# EAGLE design openusbfxo-dongle-v0.90 (EAGLE 5.11)
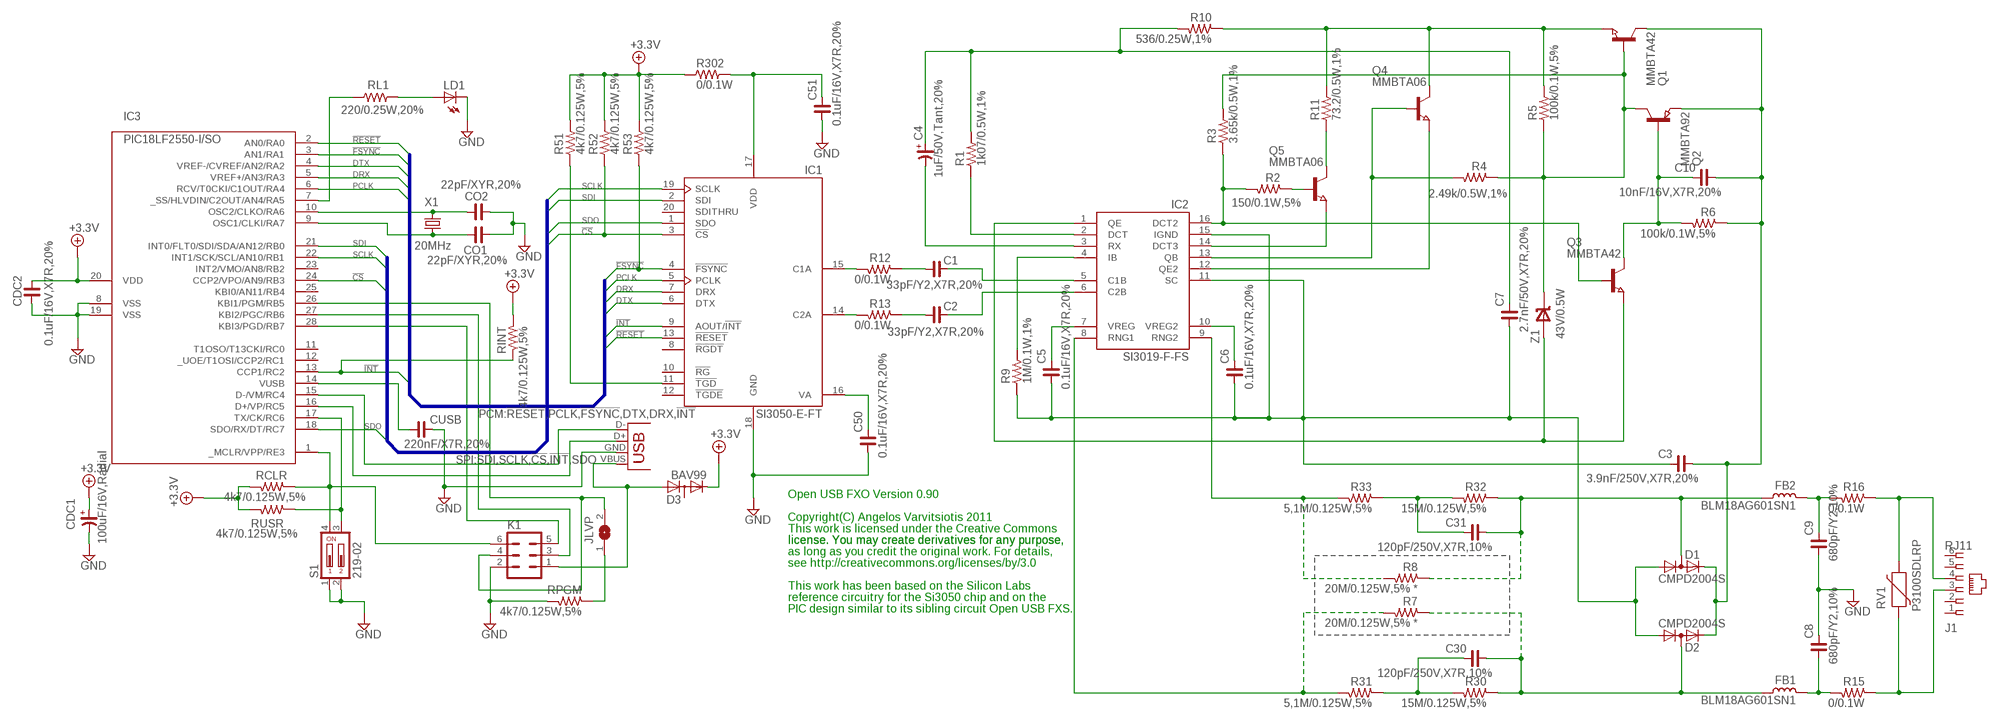
[diagram p0: schematic, sheet 1]

## Parts
C1  33pF/Y2,X7R,20%  C_0805  [C0805]
C2  33pF/Y2,X7R,20%  C_0805  [C0805]
C3  3.9nF/250V,X7R,20%  C_1812  [C1812]
C4  1uF/50V,Tant,20%  CP_6032-28R  [C6032-28R/T]
C5  0.1uF/16V,X7R,20%  C_0603  [C0603]
C6  0.1uF/16V,X7R,20%  C_0603  [C0603]
C7  2.7nF/50V,X7R,20%  C_0805  [C0805]
C8  680pF/Y2,10%  C_0603  [C0603]
C9  680pF/Y2,10%  C_0603  [C0603]
C10  10nF/16V,X7R,20%  C_0603  [C0603]
C30  120pF/250V,X7R,10%  C_1210  [C1210]
C31  120pF/250V,X7R,10%  C_1210  [C1210]
C50  0.1uF/16V,X7R,20%  C_0603  [C0603]
C51  0.1uF/16V,X7R,20%  C_0603  [C0603]
CDC1  100uF/16V,Radial  CP_E-025X060  [CE-025X060]
CDC2  0.1uF/16V,X7R,20%  C_0603  [C0603]
CO1  22pF/XYR,20%  C_0805  [C0805]
CO2  22pF/XYR,20%  C_0805  [C0805]
CUSB  220nF/X7R,20%  C_0805  [C0805]
D1  CMPD2004S  CMPD200X  [SOT23]
D2  CMPD2004S  CMPD200X  [SOT23]
D3  BAV99  [SOT23]
FB1  BLM18AG601SN1  L_0603  [L0603]
FB2  BLM18AG601SN1  L_0603  [L0603]
IC1  SI3050-E-FT  [TSSOP-20]
IC2  SI3019-F-FS  [SOIC-16]
IC3  PIC18LF2550-I/SO  [SO-28W]
J1  RJ11  RJ-11/12TH  [RJ-11/12]
JLVP  SJ  [SJ]
K1  MA03-2  [MA03-2]
K2  USB-A-H  [USB-A-H]
LD1  LEDCHIPLED_1206  [CHIPLED_1206]
Q1  MMBTA42  NPN-TRANSISTOR_SOT23  [SOT23]
Q2  MMBTA92  PNP-TRANSISTOR_SOT23  [SOT23]
Q3  MMBTA42  NPN-TRANSISTOR_SOT23  [SOT23]
Q4  MMBTA06  NPN-TRANSISTOR_SOT23  [SOT23]
Q5  MMBTA06  NPN-TRANSISTOR_SOT23  [SOT23]
R1  1k07/0.5W,1%  R_1210  [R1210]
R2  150/0.1W,5%  R_0805  [R0805]
R3  3.65k/0.5W,1%  R_1210  [R1210]
R4  2.49k/0.5W,1%  R_1210  [R1210]
R5  100k/0.1W,5%  R_0805  [R0805]
R6  100k/0.1W,5%  R_0805  [R0805]
R7  20M/0.125W,5% *  R_0805  [R0805]
R8  20M/0.125W,5% *  R_0805  [R0805]
R9  1M/0.1W,1%  R_0805  [R0805]
R10  536/0.25W,1%  R_1206  [R1206]
R11  73.2/0.5W,1%  R_1210  [R1210]
R12  0/0.1W  R_0805  [R0805]
R13  0/0.1W  R_0805  [R0805]
R15  0/0.1W  R_0603  [R0603]
R16  0/0.1W  R_0603  [R0603]
R30  15M/0.125W,5%  R_0805  [R0805]
R31  5,1M/0.125W,5%  R_0805  [R0805]
R32  15M/0.125W,5%  R_0805  [R0805]
R33  5,1M/0.125W,5%  R_0805  [R0805]
R51  4k7/0.125W,5%  R_0805  [R0805]
R52  4k7/0.125W,5%  R_0805  [R0805]
R53  4k7/0.125W,5%  R_0805  [R0805]
R302  0/0.1W  R_0603  [R0603]
RCLR  4k7/0.125W,5%  R_0805  [R0805]
RINT  4k7/0.125W,5%  R_0805  [R0805]
RL1  220/0.25W,20%  R_1206  [R1206]
RPGM  4k7/0.125W,5%  R_0805  [R0805]
RUSR  4k7/0.125W,5%  R_0805  [R0805]
RV1  P3100SDLRP  SIDACTOR  [DO-214AA]
S1  219-02  [CTS-219-02]
X1  20MHz  CRYSTALHC49S  [HC49/S]
Z1  43V/0.5W  ZENER-SOD123  [SOD-123]

## Nets
!CS: IC1.3(!CS) IC3.24(CCP2/VPO/AN9/RB3) R52.1
!FSYNC: IC1.4(!FSYNC) IC3.3(AN1/RA1) R53.1
!INT: IC1.9(AOUT/!INT) IC3.13(CCP1/RC2) RINT.2
!RESET: IC1.13(!RESET) IC3.2(AN0/RA0)
+3.3V: CDC1.+ CDC2.2 D3.2(C) IC3.20(VDD) R51.2 R52.2 R53.2 R302.1 RCLR.2 RINT.1 RUSR.2
C1B: C1.1 IC2.5(C1B)
C2B: C2.1 IC2.6(C2B)
DCT: IC2.2(DCT) R1.1
DCT2: IC2.16(DCT2) Q3.1(B) R2.2 R3.1
DCT3: IC2.14(DCT3) Q5.2(E)
DRX: IC1.7(DRX) IC3.5(VREF+/AN3/RA3)
DTX: IC1.6(DTX) IC3.4(VREF-/CVREF/AN2/RA2)
GND: C8.2 C9.1 C50.1 C51.1 CDC1.- CDC2.1 CO1.1 CO2.1 CUSB.2 IC1.18(GND) IC3.8(VSS) IC3.19(VSS) K1.2 K2.GND(VBUS) LD1.C RPGM.2 S1.1 S1.2
IB: IC2.4(IB) R9.2
IGND: C3.2 C5.1 C6.1 C7.1 D1.1(A) D2.1(A) IC2.11(SC) IC2.15(IGND) R9.1
IVCC: C3.1 C10.1 D1.2(K) D2.2(K) Q1.3(C) Q2.2(E) R6.1
N$1: C50.2 IC1.16(VA)
N$6: C4.+ C7.2 R1.2 R10.2
N$9: Q1.1(B) Q2.3(C) R3.2 R4.1 R5.1 Z1.C
N$10: C10.2 Q2.1(B) Q3.3(C) R6.2
N$13: C1.2 R12.1
N$15: C2.2 R13.1
N$16: IC1.15(C1A) R12.2
N$17: IC1.14(C2A) R13.2
N$18: Q1.2(E) Q4.3(C) R5.2 R10.1 R11.2
N$19: C9.2 FB2.2 R16.2
N$20: Q5.3(C) R11.1
N$21: Q5.1(B) R2.1
N$26: C31.2 R32.2 R33.1
N$27: C30.2 R30.2 R31.1
N$28: C30.1 D2.3(AK) FB1.1 R7.1 R30.1
N$29: IC1.11(!TGD) R51.1
N$31: C31.1 D1.3(AK) FB2.1 R8.1 R32.1
N$33: J1.4 R16.1 RV1.P$2
N$34: C8.1 FB1.2 R15.2
N$35: J1.3 R15.1 RV1.P$1
N$36: IC3.7(_SS/HLVDIN/C2OUT/AN4/RA5) RL1.1
N$37: LD1.A RL1.2
N$38: C51.2 IC1.17(VDD) R302.2
N$39: CO2.2 IC3.10(OSC2/CLKO/RA6) X1.2
N$40: CO1.2 IC3.9(OSC1/CLKI/RA7) X1.1
N$41: CUSB.1 IC3.14(VUSB)
N$42: IC3.15(D-/VM/RC4) K2.D-(D+)
N$43: IC3.16(D+/VP/RC5) K2.D+(D-)
N$44: IC3.1(_MCLR/VPP/RE3) K1.6 RCLR.1 S1.4
N$45: IC3.17(TX/CK/RC6) RUSR.1 S1.3
N$46: IC3.28(KBI3/PGD/RB7) K1.5
N$47: JLVP.1 RPGM.1
N$49: IC3.27(KBI2/PGC/RB6) K1.3
N$50: IC3.26(KBI1/PGM/RB5) JLVP.2 K1.4
PCLK: IC1.5(PCLK) IC3.6(RCV/T0CKI/C1OUT/RA4)
QB: IC2.13(QB) Q4.1(B) R4.2
QE: IC2.1(QE) Q3.2(E) Z1.A
QE2: IC2.12(QE2) Q4.2(E)
RNG1: IC2.8(RNG1) R7.2 R31.2
RNG2: IC2.9(RNG2) R8.2 R33.2
RX: C4.- IC2.3(RX)
SCLK: IC1.19(SCLK) IC3.22(INT1/SCK/SCL/AN10/RB1)
SDI: IC1.2(SDI) IC3.21(INT0/FLT0/SDI/SDA/AN12/RB0)
SDO: IC1.1(SDO) IC3.18(SDO/RX/DT/RC7)
VBUS: D3.1(A) K1.1 K2.VBUS(GND)
VREG: C5.2 IC2.7(VREG)
VREG2: C6.2 IC2.10(VREG2)
Unconnected: D3.3(AC) IC1.8(!RGDT) IC1.10(!RG) IC1.12(!TGDE) IC1.20(SDITHRU) IC3.11(T1OSO/T13CKI/RC0) IC3.12(_UOE/T1OSI/CCP2/RC1) IC3.23(INT2/VMO/AN8/RB2) IC3.25(KBI0/AN11/RB4) J1.1 J1.2 J1.5 J1.6

## Buses
PCM:!RESET,PCLK,!FSYNC,DTX,DRX,!INT
SPI:SDI,SCLK,!CS,!INT,SDO

## Notes on the sheet
- Open USB FXO Version 0.90
- Copyright(C) Angelos Varvitsiotis 2011
- This work is licensed under the Creative Commons
- license. You may create derivatives for any purpose, | license. You may create derivatives for any purpose,
- as long as you credit the original work. For details,
- see http://creativecommons.org/licenses/by/3.0
- This work has been based on the Silicon Labs
- reference circuitry for the Si3050 chip and on the
- PIC design similar to its sibling circuit Open USB FXS.

## Library data of the parts
C1-C3 C5-C10 C30 C31 C50 C51 CDC2 CO1 CO2 CUSB = rc-master:C_: NON-POLARIZED CAP
C4 CDC1 = rc-master:CP_: POLARIZED CAP
D1 D2 = fxosemi:CMPD200X: Central Semiconductor dual diodes CMP2003 and CMP2004
D3 = sevt:BAV99
FB1 FB2 = rc-master:L_: INDUCTOR
IC1 = SiLabs3050-18:SI3050-E-FT: Silicon Labs Si3050
IC2 = SiLabs3050-18:SI3019-F-FS: Silicon Labs Si3019
IC3 = microchip-pic18fxx5x:PIC18*2550: PIC18*2550 Microchip FLASH Microcontroller with FS-USB DEVICE FEATURES Feature PIC18*2550 Program Memory (bytes) 32k Program Memory (instructions) 16384 I/O Ports Ports A, B, C, (E) Capture/Compare/PWM Modules 2 Enhanced Capture/Compare/PWM Modules 0 Parallel Communications (PSP) No 10-bit Analog-to-Digital Module 10 input Channels Package Types 28-pin PDIP 28-pin SOIC NOTES: F only after 18, means standard voltage range from 4.2v to 5.5v LF after 18, means extended voltage range from 2.0v to 5.5v T after entire device number, means supplied in tape and reel TQFP packages only -E before / denotes extended temperature range from -40°C to +120°C -I before / denotes industrial temperature range from -40°C to +85°C /PT suffix denotes TQFP package /SO suffix denotes SOIC package /SP suffix denotes Skinny Plastic DIP package /P suffix denotes Plastic DIP package /ML suffix denotes QFN package
J1 = connectors:RJ-11/12: 6 Pin RJ-12 Connector Digikey Part Number: A9031-ND
JLVP = jumper:SJ: SMD solder JUMPER
K1 = con-lstb:MA03-2: PIN HEADER
K2 = SparkFun:USB: USB Connectors USB-B-PTH is fully proven SKU : PRT-00139 USB-miniB is fully proven SKU : PRT-00587 USB-A-PCB is untested. USB-A-H is throughly reviewed, but untested. Spark Fun Electronics SKU : PRT-00437 USB-B-SMT is throughly reviewed, but untested. Needs silkscreen touching up. USB-A-S has not been used/tested USB-MB-H has not been used/tested
LD1 = led:LED: LED OSRAM: - CHIPLED LG R971, LG N971, LY N971, LG Q971, LY Q971, LO R971, LY R971 LH N974, LH R974 LS Q976, LO Q976, LY Q976 LO Q996 - Hyper CHIPLED LW Q18S LB Q993, LB Q99A, LB R99A - SideLED LS A670, LO A670, LY A670, LG A670, LP A670 LB A673, LV A673, LT A673, LW A673 LH A674 LY A675 LS A676, LA A676, LO A676, LY A676, LW A676 LS A679, LY A679, LG A679 - Hyper Micro SIDELED® LS Y876, LA Y876, LO Y876, LY Y876 LT Y87S - SmartLED LW L88C, LW L88S LB L89C, LB L89S, LG L890 LS L89K, LO L89K, LY L89K LS L896, LA L896, LO L896, LY L896 - TOPLED LS T670, LO T670, LY T670, LG T670, LP T670 LSG T670, LSP T670, LSY T670, LOP T670, LYG T670 LG T671, LOG T671, LSG T671 LB T673, LV T673, LT T673, LW T673 LH T674 LS T676, LA T676, LO T676, LY T676, LB T676, LH T676, LSB T676, LW T676 LB T67C, LV T67C, LT T67C, LS T67K, LO T67K, LY T67K, LW E67C LS E67B, LA E67B, LO E67B, LY E67B, LB E67C, LV E67C, LT E67C LW T67C LS T679, LY T679, LG T679 LS T770, LO T770, LY T770, LG T770, LP T770 LB T773, LV T773, LT T773, LW T773 LH T774 LS E675, LA E675, LY E675, LS T675 LS T776, LA T776, LO T776, LY T776, LB T776 LHGB T686 LT T68C, LB T68C - Hyper Mini TOPLED® LB M676 - Mini TOPLED Santana® LG M470 LS M47K, LO M47K, LY M47K Source: http://www.osram.convergy.de LUXEON: - LUMILED® LXK2-PW12-R00, LXK2-PW12-S00, LXK2-PW14-U00, LXK2-PW14-V00 LXK2-PM12-R00, LXK2-PM12-S00, LXK2-PM14-U00 LXK2-PE12-Q00, LXK2-PE12-R00, LXK2-PE12-S00, LXK2-PE14-T00, LXK2-PE14-U00 LXK2-PB12-K00, LXK2-PB12-L00, LXK2-PB12-M00, LXK2-PB14-N00, LXK2-PB14-P00, LXK2-PB14-Q00 LXK2-PR12-L00, LXK2-PR12-M00, LXK2-PR14-Q00, LXK2-PR14-R00 LXK2-PD12-Q00, LXK2-PD12-R00, LXK2-PD12-S00 LXK2-PH12-R00, LXK2-PH12-S00 LXK2-PL12-P00, LXK2-PL12-Q00, LXK2-PL12-R00 Source: www.luxeon.com KINGBRIGHT: KA-3528ASYC Source: www.kingbright.com
Q1 Q3-Q5 = semicon-smd-ipc:NPN-TRANSISTOR_: NPN TRANSISTOR
Q2 = semicon-smd-ipc:PNP-TRANSISTOR_: PNP TRANSISTOR
R1-R13 R15 R16 R30-R33 R51-R53 R302 RCLR RINT RL1 RPGM RUSR = rc-master:R_: RESISTOR
RV1 = fxosemi:SIDACTOR
S1 = switch-dil:219-02*: Surface Mount DIP Switch Series 219 SMT CTS Electronic Components Sourc: www.ctscorp.com
X1 = crystal:CRYSTAL: CRYSTAL
Z1 = fxosemi:ZENER-SOD123: Zener Diode with SOD-123 package

## Board
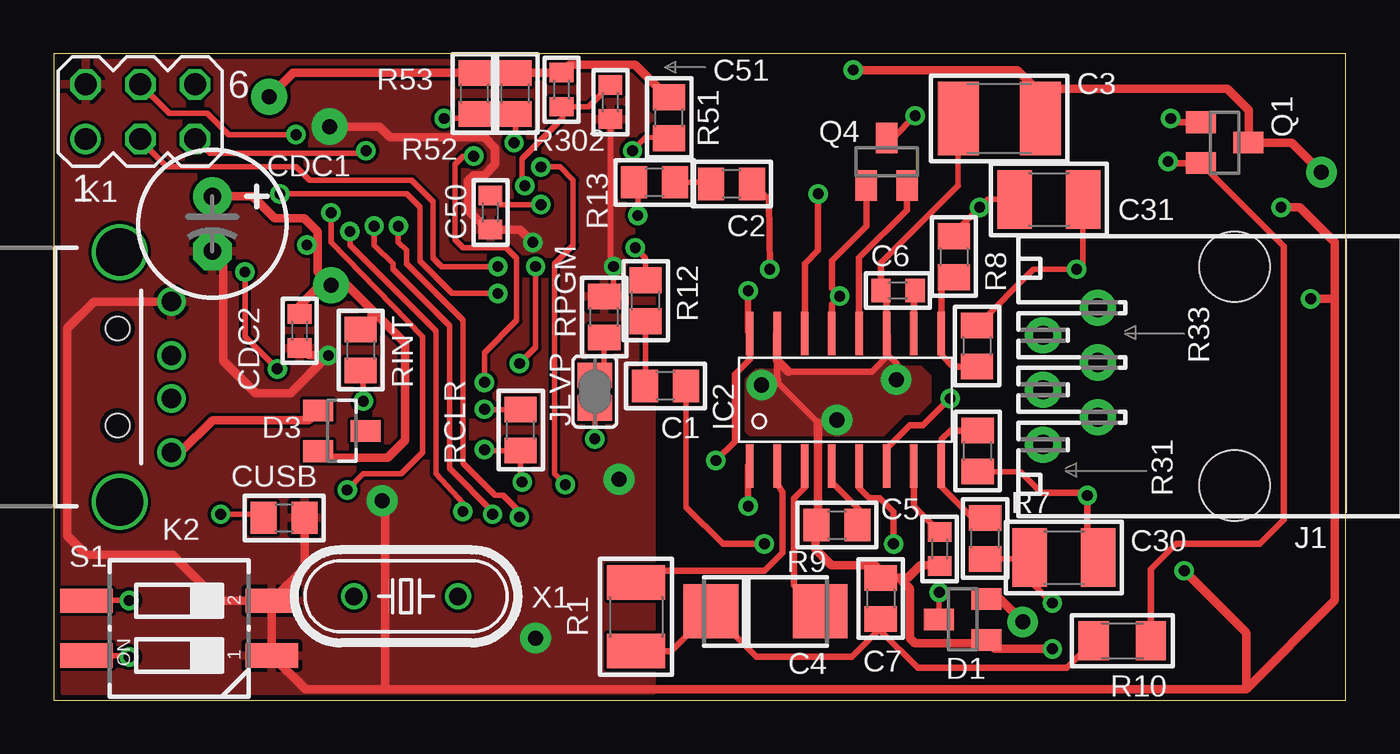
[diagram p1: board, top side]
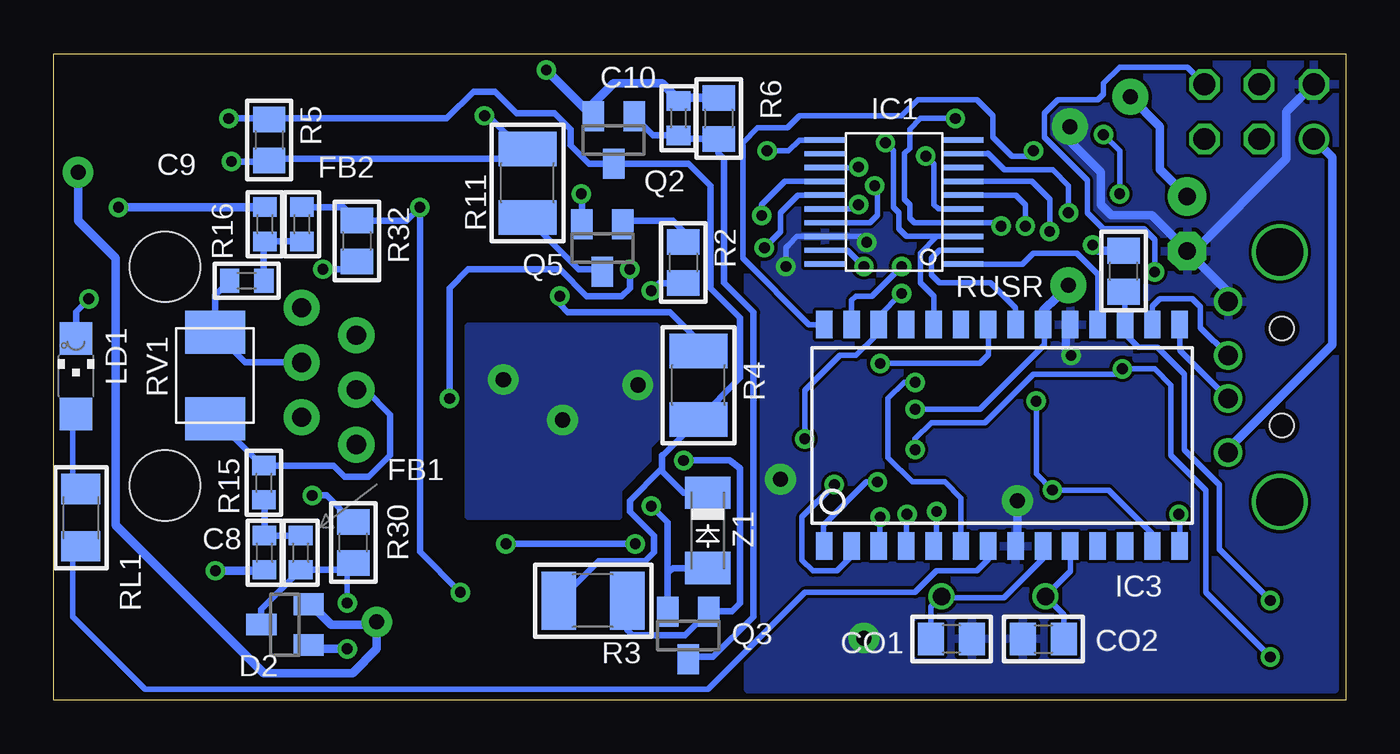
[diagram p2: board, bottom side, seen from below]

Size 60 x 30 mm. Coordinates in mm from the lower left corner, seen from the top.
Outline: 0,0 60,0 60,30 0,30 0,0
Copper layers (1*16): Top 0.018mm / dielectric 1.55mm / Bottom 0.018mm
Design rules "eC-PCB_proto-2-layer *": minimum track width 0.15mm, minimum drill 0.25mm, track to track 0.15mm, track to pad 0.15mm, pad to pad 0.15mm, via to via 0.15mm, smd to smd 0.15mm, copper to edge 0.25mm, drill to drill 0.3mm, minimum pad ring 0.2mm, minimum via ring 0.2mm, stop-mask expansion 0.1mm, vias tented up to drill 0mil, thermal gap 0.2mm

### Footprints (pad centres in the part's own frame; a part is rotated, then mirrored left to right if it is on the bottom)
C0805 = smd 1.2 x 1.5: 1 -0.953,0; 2 0.953,0
C1812 = smd 1.905 x 3.404: 1 -1.905,0; 2 1.905,0
C6032-28R/T = smd 2.55 x 2.5: + 2.54,0; - -2.54,0
C0603 = smd 0.9 x 1.1: 1 -0.794,0; 2 0.794,0
C1210 = smd 1.6 x 2.7: 1 -1.587,0; 2 1.587,0
CE-025X060 = drill 0.813 pad 1.778 round: + -1.27,0 | drill 0.813 pad 1.778 octagon: - 1.27,0
SOT23 = smd 1 x 1.4: 1 -0.95,-1.1; 2 0.95,-1.1; 3 0,1.1
L0603 = smd 0.9 x 1.1: 1 -0.794,0; 2 0.794,0
TSSOP-20 = smd 0.25 x 1.92: 1 -3.2,-2.88; 2 -2.56,-2.88; 3 -1.92,-2.88; 4 -1.28,-2.88; 5 -0.64,-2.88; 6 0,-2.88; 7 0.64,-2.88; 8 1.28,-2.88; 9 1.92,-2.88; 10 2.56,-2.88; 11 2.56,3.52; 12 1.92,3.52; 13 1.28,3.52; 14 0.64,3.52; 15 0,3.52; 16 -0.64,3.52; 17 -1.28,3.52; 18 -1.92,3.52; 19 -2.56,3.52; 20 -3.2,3.52
SOIC-16 = smd 0.35 x 2: 1 -4.445,-3.075; 2 -3.175,-3.075; 3 -1.905,-3.075; 4 -0.635,-3.075; 5 0.635,-3.075; 6 1.905,-3.075; 7 3.175,-3.075; 8 4.445,-3.075; 9 4.445,3.075; 10 3.175,3.075; 11 1.905,3.075; 12 0.635,3.075; 13 -0.635,3.075; 14 -1.905,3.075; 15 -3.175,3.075; 16 -4.445,3.075
SO-28W = smd 0.762 x 1.27: 1 -7.62,-5.207; 2 -6.35,-5.207; 3 -5.08,-5.207; 4 -3.81,-5.207; 5 -2.54,-5.207; 6 -1.27,-5.207; 7 0,-5.207; 8 1.27,-5.207; 9 2.54,-5.207; 10 3.81,-5.207; 11 5.08,-5.207; 12 6.35,-5.207; 13 7.62,-5.207; 14 8.89,-5.207; 15 8.89,5.08; 16 7.62,5.08; 17 6.35,5.08; 18 5.08,5.08; 19 3.81,5.08; 20 2.54,5.08; 21 1.27,5.08; 22 0,5.08; 23 -1.27,5.08; 24 -2.54,5.08; 25 -3.81,5.08; 26 -5.08,5.08; 27 -6.35,5.08; 28 -7.62,5.08
RJ-11/12 = drill 0.889 pad 1.676 round: 1 -3.175,7.747; 2 -1.905,5.207; 3 -0.635,7.747; 4 0.635,5.207; 5 1.905,7.747; 6 3.175,5.207 | hole 3.251: -5.08,-1.143; 5.08,-1.143
SJ = smd 1.168 x 1.6: 1 -0.762,0; 2 0.762,0
MA03-2 = drill 1.016 round: 1 -2.54,-1.27 | drill 1.016 octagon: 2 -2.54,1.27; 3 0,-1.27; 4 0,1.27; 5 2.54,-1.27; 6 2.54,1.27
USB-A-H = drill 0.914 round: D+ 2.4,1; D- 2.4,-1; GND 2.4,3.5; VBUS 2.4,-3.5 | drill 2.2 round: GND@1 0,5.8; GND@2 0,-5.8 | hole 1.1: -0.1,2.25; -0.1,-2.25
CHIPLED_1206 = smd 1.5 x 1.5: A 0,-1.75; C 0,1.75
R1210 = smd 1.6 x 2.7: 1 -1.587,0; 2 1.587,0
R0805 = smd 1.2 x 1.5: 1 -0.953,0; 2 0.953,0
R1206 = smd 1.4 x 1.8: 1 -1.329,0; 2 1.329,0
R0603 = smd 0.9 x 1.1: 1 -0.794,0; 2 0.794,0
DO-214AA = smd 2 x 2.8: P$1 -2,0; P$2 2,0
CTS-219-02 = smd 1.13 x 2.44: 1 -1.27,-4.3; 2 1.27,-4.3; 3 1.27,4.3; 4 -1.27,4.3
HC49/S = drill 0.813 round: 1 -2.413,0; 2 2.413,0
SOD-123 = smd 1.5 x 2.1: A 1.75,0; C -1.75,0

### Placement (x,y rotation side)
C1  28.41,14.59 180 top
C2  31.48,23.96 180 top
C3  43.91,27 180 top
C4  33.05,4.12 180 top
C5  41.14,7.01 90 top
C6  39.21,19.01 0 top
C7  38.41,4.71 270 top
C8  50.22,6.84 270 bottom
C9  50.2,22.09 270 bottom
C10  30.99,27.01 270 bottom
C30  46.91,6.62 0 top
C31  46.22,23.24 0 top
C50  20.28,22.64 90 top
C51  25.85,27.76 90 top
CDC1  7.36,22.11 270 top
CDC2  11.42,17.14 90 top
CO1  18.3,2.83 180 bottom
CO2  14.04,2.83 0 bottom
CUSB  10.7,8.46 0 top
D1  42.21,3.75 90 top
D2  49.26,3.5 90 bottom
D3  13.38,12.5 270 top
FB1  48.53,6.84 90 bottom
FB2  48.48,22.09 270 bottom
IC1  20.66,23.44 90 bottom
IC2  36.77,13.94 0 top
IC3  16.6,12.35 0 bottom
J1  53.7,15.04 90 top
JLVP  25.13,14.32 270 top
K1  4.02,27.32 0 top
K2  3.06,14.99 0 top
LD1  58.97,15.04 0 bottom
Q1  54.38,25.88 270 top
Q2  34,26 180 bottom
Q3  30.53,3 180 bottom
Q4  38.68,24.99 0 top
Q5  34.52,20.99 180 bottom
R1  27.05,3.86 270 top
R2  30.76,20.31 270 bottom
R3  34.95,4.61 180 bottom
R4  30.06,14.61 90 bottom
R5  50,26 270 bottom
R6  29.12,27 270 bottom
R7  43.25,7.5 90 top
R8  41.8,20.59 270 top
R9  36.38,8.12 0 top
R10  49.62,2.75 180 top
R11  38,24 90 bottom
R12  27.48,18.54 90 top
R13  27.91,24.04 180 top
R15  50.24,10.09 270 bottom
R16  51.04,19.46 0 bottom
R30  46.09,7.31 90 bottom
R31  42.91,11.56 90 top
R32  45.93,21.31 270 bottom
R33  42.88,16.43 270 top
R51  28.57,27.04 90 top
R52  21.43,28.16 90 top
R53  19.55,28.16 90 top
R302  23.59,28.34 270 top
RCLR  21.68,12.54 90 top
RINT  14.25,16.25 270 top
RL1  58.74,8.46 90 bottom
RPGM  25.56,17.79 90 top
RUSR  10.31,19.91 90 bottom
RV1  52.51,15.06 90 bottom
S1  5.83,3.33 90 top
X1  16.36,4.82 180 top
Z1  29.62,7.88 270 bottom

### Tracks (layer width: path | path; a pad name or v marks a point on that pad's centre or on a via)
!CS  (via drill 0.5)
  Top 0.25: 21.5,27.14 R52.1 21.43,25.93 v21.38,25.88
  Bottom 0.25: IC3.24 19.12,17.45 19.12,18.75 19.75,19.38 19.75,20.75 18.98,21.52 IC1.3 20.39,21.52 20.75,21.88 20.75,22.62 21,22.88 21,23 21,25.5 v21.38,25.88
!FSYNC  (via drill 0.5)
  Top 0.25: v18.12,27 19.75,27 R53.1 | v21.62,8.5 21.62,8.75 20.88,9.5 20.5,9.5 19,11 19,17.62 16.38,20.25 16.38,20.88 16,21.25 v16,22
  Bottom 0.25: v16,22 16.16,22.16 IC1.4 20.04,22.16 20.25,22.38 20.25,23 20.5,23.25 20.5,25.38 20.25,25.62 20.25,26.5 19.75,27 v18.12,27 | IC3.3 21.62,7.2 v21.62,8.5
!INT  (via drill 0.5)
  Top 0.25: v12.88,22.62 12.88,21.25 17.12,16.88 17.12,11.5 16.12,10.5 14.38,10.5 v13.62,9.75 13.88,10 | RINT.2 14.38,15.3 v14.38,13.88
  Bottom 0.25: v12.88,22.62 12.88,23.88 13.61,24.61 15.86,24.61 16.62,25.38 16.64,25.36 IC1.9 | IC3.13 9,7.16 9,7.75 11,9.75 v13.62,9.75 14.38,10.5 v14.38,13.88
!RESET  (via drill 0.5)
  Top 0.25: v22.62,24.75 23.5,24.75 24.12,24.12 24.12,21.12 23.25,20.25 23.25,10.5 v23.75,10
  Bottom 0.25: IC1.13 22.53,24.72 v22.62,24.75 | v23.75,10 25.25,8.5 25.25,6.5 24.75,6 23.62,6 23,6.62 23,7.09 IC3.2
+3.3V  (via drill 0.5, 0.7 pad 1.68)
  Top 0.25: RCLR.2 20.01,13.49 v20,13.5 | 12.25,20.88 12.25,21.12
  Top 0.4: 14.75,18.12 16.31,16.56 16.31,12.06 15.5,11.25 13.12,11.25 12.57,11.25 D3.2 | 14.75,18.12 13.62,19.25 v12.88,19.25 | v10,28 11.11,29.11 R53.2 R52.2 21.46,29.13 R302.1 23.95,29.5 27,29.5 28.51,27.99 R51.2 | v12.88,19.25 12.38,19.25 | CDC2.2 11.42,18.3 12.38,19.25 | CDC1.+ 9.24,23.38 10.25,22.38 11.62,22.38 12.25,21.75 12.25,21.12 | 12.38,19.25 12.25,19.25 | 12.25,21.12 12.25,20.88 12.25,19.88 v12.88,19.25 | 12.25,21.12 v11.75,21.12 | RINT.1 14.75,17.2 14.75,18.12
  Bottom 0.25: v20,13.5 17,13.5 14,16.5 14,17.37 IC3.20
  Bottom 0.4: v10,28 8.62,26.62 8.62,24.62 8.61,24.62 CDC1.+ | IC3.20 14.06,18.07 13.38,18.75 v12.88,19.25 | RUSR.2 11.49,20.86 v11.75,21.12
C1B  (via drill 0.5)
  Top 0.25: 31.07,7.25 29.36,8.96 C1.1
  Top 0.3: IC2.5 37.41,9.85 37.88,9.38 38.38,9.38 39,8.75 v39,7.25 | v33,7.25 31.07,7.25
  Bottom 0.3: v33,7.25 v39,7.25
C2B  (via drill 0.5)
  Top 0.3: IC2.6 38.67,11.68 39.75,12.75 40.38,12.75 v41.62,14 | v33.25,20 33.22,23.25 C2.1
  Bottom 0.3: v41.62,14 41.62,19.12 40.75,20 36.5,20 35.25,18.75 33.62,18.75 33.25,19.12 v33.25,20
DCT
  Top 0.3: R1.1 27.35,6 33,6 33.84,6.84 33.84,9.65 33.62,10 33.62,10.84 IC2.2
DCT2  (via drill 0.5)
  Top 0.3: v30.75,11.12 31.62,12 31.62,15.12 32.33,15.82 IC2.16 32.25,17.09 v32.25,19
  Bottom 0.3: v32.25,19 31.89,19.36 R2.2 | R3.1 33.36,3.24 33.12,3 30.68,3 Q3.1 29.55,4.12 28.5,4.12 28.12,4.5 28.12,10.75 28.62,11.12 v30.75,11.12
DCT3  (via drill 0.5)
  Top 0.3: IC2.14 34.88,20.25 35.5,20.88 v35.5,23.5
  Bottom 0.3: v35.5,23.5 35.47,23.47 Q5.2
DRX  (via drill 0.5)
  Top 0.25: v13.75,21.75 13.75,21.12 17.75,17.12 17.75,10.5 19,9.12 v19,8.75
  Bottom 0.25: IC1.7 14.58,24.08 13.75,23.25 v13.75,21.75 | v19,8.75 19,7.28 IC3.5
DTX  (via drill 0.5)
  Top 0.25: v14.88,22 14.88,21.12 15.75,20.25 15.75,20 18.38,17.38 18.38,10.75 20.38,8.75 v20.38,8.62
  Bottom 0.25: IC1.6 15.31,23.44 14.88,23 v14.88,22 | IC3.4 20.41,8.62 v20.38,8.62
GND  (via drill 0.5, 0.7 pad 1.42, 0.7 pad 1.68)
  Top 0.25: RPGM.2 26,19.18 v26,20.12 25.85,20.27 C51.1 | 11.89,16 CDC2.1
  Top 0.3: 59.5,18.75 59.38,18.62
  Top 0.4: 15.38,0.5 11.69,0.5 S1.1 S1.2 | 15.38,0.5 55.38,0.5 | 55.38,0.5 59.5,4.62 59.5,18.75 59.5,21.25 57.88,22.88 v57,22.88 | 55.38,0.5 55.38,3.12 v52.5,6 | 59.38,18.62 v58.38,18.62 | CDC1.- 7.88,20.32 7.88,15.75 9.38,14.25 11,14.25 v12.75,16 11.89,16 CDC2.1 | S1.2 7.64,4.61 5.5,6.75 1.5,6.75 0.62,7.62 0.62,17.25 1.88,18.5 K2.GND | v12.81,26.62 15.12,26.62 15.62,26.12 20,26.12 20.5,25.62 20.5,24.88 20,24.38 19.5,24.38 19.25,24.12 19.25,22.75 20.16,21.84 C50.1 21.66,21.84 v22.25,21.25 | 15.38,0.5 15.38,9.12 v15.25,9.25 | CUSB.2 11.65,6.13 S1.2
  Bottom 0.25: v22.25,21.25 22.52,21.52 IC1.18 25.48,21.52 25.88,21.12 26,21 v26,20.12 | IC3.19 12.88,17.43 12.88,17.12 13,17
  Bottom 0.3: 50.26,6 C8.2 | LD1.C 58.97,18.03 v58.38,18.62 | C9.1
  Bottom 0.4: v52.5,6 50.26,6 | v57,22.88 C9.1 | 13,17 13,16.25 v12.75,16 | K2.GND 5.46,18.94 CDC1.- | CDC1.- 7.04,20.84 2.75,25.12 2.75,27.32 K1.2 | v15.25,9.25 15.25,7.22 IC3.8 | CDC1.- 7.36,20.86 9,22.5 10.88,22.5 11.38,23 11.38,24.5 12.75,25.88 12.75,26.57 v12.81,26.62
  other vias: 26.25,10.25 22.38,2.88
  pour Bottom: 0.5,29.5 0.5,0.5 27.75,0.5 27.75,29.5
  pour Top: 0.5,0.38 0.5,29.62 27.88,29.62 27.88,29.5 27.75,29.5 27.75,0.38
IB
  Top 0.3: IC2.4 36.13,10.12 37.38,8.88 37.38,8.17 R9.2
IGND  (via drill 0.5, 0.7 pad 1.42)
  Top 0.25: 42,23.88 42,25.86
  Top 0.3: 41.16,6.22 C5.1 41.12,6.2 | 43.31,2.81 D1.1 | IC2.15 33.59,14.78 35.5,12.88 v36.38,13 | 35.5,8.2 R9.1 35.38,8.08 | 34.12,15.25 37.88,15.25 38,15.25 38.75,16 | 38.75,16 38.75,16.94 IC2.11 38.67,18.75 C6.1 38.42,20.29 42,23.88 | 42,25.86 C3.2 | 38.71,5.67 C7.1 | v32.88,14.62 32.88,14.88 33.62,14.88 | v39.12,14.88 39.12,15.62 38.75,16
  Top 0.4: C7.1 39.25,5.67 | 39.25,5.67 39.67,5.67 40.25,6.25 41.11,6.25 C5.1 | 35.5,8.2 35.5,12.88 | IC2.15 33.59,15.78 34.12,15.25 | 35.38,8.08 35.38,7 36.12,6.25 38.12,6.25 38.71,5.67 | 43.31,2.81 43.06,2.81 42.88,2.62 40,2.62 39.75,2.88 39.75,5.17 39.25,5.67 | D1.1 43.72,2.38 v46.38,2.38
  Bottom 0.3: 48.12,2.5 D2.1
  Bottom 0.4: 48.12,2.5 47.99,2.38 v46.38,2.38
  pour Bottom: 32,17.38 40.75,17.38 40.75,8.5 33.75,8.5 33.75,9.75 32.38,11.12 32.38,11.75 32,12.12
  pour Top: 32.38,12.38 38.5,12.38 39.5,13.38 40.12,13.38 40.62,13.88 40.62,15 40.25,15.38 39.38,15.38 38.75,16 38,15.25 32.62,15.25 32.25,14.88 32.25,12.5
IVCC  (via drill 0.5, 0.7 pad 1.42)
  Top 0.4: v45,3.62 43.93,4.7 D1.2 | v58.88,24.5 57.5,25.88 Q1.3 55.5,25.9 55.5,27.38 54.5,28.38 46.12,28.38 45.88,28.12 | 45.88,28.12 44.75,29.25 v37.12,29.25 | 45.88,28.12 45.88,27.05 C3.1
  Bottom 0.3: D2.2 48.1,4.5 | 34.98,27.1 Q2.2 | 30.99,27.86 C10.1 30.84,27.95
  Bottom 0.4: v58.88,24.5 58.88,22.25 57.12,20.5 57.12,8.12 50.25,1.25 46.12,1.25 45,2.38 v45,3.62 45.12,3.5 47.12,3.5 48.07,4.45 D2.2 | v37.12,29.25 34.98,27.1 | Q2.2 34.95,27.68 34,28.62 31.75,28.62 30.99,27.86 | 30.84,27.95 R6.1
N$1  (via drill 0.5)
  Top 0.25: v22.62,23 20.71,23 C50.2
  Bottom 0.25: IC1.16 22.82,22.8 v22.62,23
N$6
  Top 0.3: 38.78,3.72 C7.2 | R10.2 47.05,1.5 40.12,1.5 38.38,3.25 38.78,3.65 38.78,3.72 | 38.78,3.72 37.06,2 32.62,2 C4.+ 28.67,2.27 R1.2
N$9  (via drill 0.5)
  Top 0.3: Q1.1 52.05,26.82 v51.88,27
  Bottom 0.3: v51.88,27 50.05,27 R5.1 49.95,27 41.75,27 40.5,28.25 39.5,28.25 38.5,27.25 36.75,27.25 36,26.5 36,25.75 35.15,24.9 Q2.3 30.52,24.9 29.5,23.88 29.5,19.12 28.12,17.75 28.12,14.96 R4.1 | R3.2 34.71,6.44 32.55,6.44 32.12,6.87 32.12,7.62 33.25,8.75 33.25,9.25 31.81,10.69 | R4.1 30.08,13 | 31.75,10.62 31.81,10.69 | 31.75,10.62 31.75,11.38 31.71,11.38 R4.1 | 31.75,10.62 31.81,10.69 | 31.75,10.62 30.75,9.62 Z1.C
N$10
  Bottom 0.3: Q2.1 32.17,26.22 C10.2 30.82,26.05 | 30.82,26.05 R6.2 29.12,25.38 28.88,25.12 28.88,19.38 27.5,18 27.5,3.88 29.38,2 30.43,2 Q3.3 | 30.82,26.05 30.42,26.05
N$13
  Top 0.25: C1.2 27.48,14.61 R12.1
N$15
  Top 0.25: C2.2 30.45,24.04 R13.1
N$16  (via drill 0.5)
  Top 0.25: R12.2 27.48,20.52 v27,21
  Bottom 0.25: v27,21 26.25,21.75 26.25,22.62 25.43,23.44 IC1.15
N$17  (via drill 0.5)
  Top 0.25: R13.2 27.12,23.61 v27.12,22.5
  Bottom 0.25: IC1.14 26.05,24.08 27.12,23 v27.12,22.5
N$18  (via drill 0.5)
  Top 0.3: R10.1 50.95,6.08 52.12,7.25 56,7.25 57.12,8.38 57.12,21.07 Q1.2 51.83,24.93 v51.75,25 | v40,27.12 38.97,26.09 Q4.3
  Bottom 0.3: v51.75,25 50.05,25 R5.2 49.92,25.12 38.75,25.12 38.29,25.59 | 38.29,25.59 R11.2 | 38.29,25.59 39.83,27.12 v40,27.12
N$19
  Bottom 0.3: R16.2 50.25,21.25 C9.2 FB2.2
N$20
  Bottom 0.3: Q5.3 34.63,20 35.62,20 38,22.38 R11.1
N$21
  Bottom 0.3: Q5.1 33.41,22.25 31.25,22.25 30.26,21.26 R2.1
N$26  (via drill 0.5)
  Top 0.25: R33.1 45.5,20 v47.5,20 47.8,20.3 C31.2
  Bottom 0.3: v47.5,20 46.29,20 R32.2
N$27  (via drill 0.5)
  Top 0.25: 48,7.12 C30.2 | R31.1 44.89,10.61 45.88,9.62
  Top 0.3: 45.88,9.62 47.88,9.62 v48,9.5 48,7.12
  Bottom 0.3: v48,9.5 47.33,9.5 R30.2
N$28  (via drill 0.5)
  Top 0.25: v46.38,4.5 45.33,5.55 C30.1 45.26,6.55 R7.1
  Top 0.3: R7.1 43.4,6.4
  Bottom 0.25: R30.1 46.38,6.07 v46.38,4.5
  Bottom 0.3: 46.12,6.32 R30.1 46.4,6.05 FB1.1 50.36,4.22 D2.3
N$29  (via drill 0.5)
  Top 0.25: v26.88,25.5 27.49,26.12 R51.1
  Bottom 0.25: IC1.11 25.38,26 25.88,25.5 v26.88,25.5
N$31  (via drill 0.5)
  Top 0.25: D1.3 41.11,4.99 v41.12,5 | R8.1 41.8,21.68 v43,22.88 43.37,23.24 C31.1
  Bottom 0.3: FB2.1 46.55,22.88 R32.1 43.61,22.26 v43,22.88 43,6.88 v41.12,5
N$33
  Bottom 0.3: J1.4 51.12,15.67 RV1.P$2 52.51,18.79 R16.1
N$34
  Bottom 0.3: R15.2 50.22,9.33 C8.1 FB1.2
N$35
  Bottom 0.3: J1.3 45.52,14.4 44.38,13.25 44.38,11.38 45.38,10.38 46.5,10.38 47,10.88 49.11,10.88 R15.1 50.33,10.88 RV1.P$1
N$36
  Bottom 0.25: IC3.7 16.6,6.53 17.12,6 19,6 20,5 25.12,5 29.62,0.5 55.75,0.5 59.12,3.88 59.12,7.01 RL1.1
N$37
  Bottom 0.25: 59.12,13.26 59.12,10.17 RL1.2
  Bottom 0.3: LD1.A 59.12,13.26
N$38  (via drill 0.5)
  Top 0.25: 23.62,27.51 R302.2 | C51.2 24.84,27.55 R302.2 | 23.62,27.51 23.62,27 21.75,25.12 21.75,24 v21.88,23.88 | 23.62,27.51 R302.2
  Bottom 0.25: IC1.17 22.09,22.16 21.75,22.5 21.75,23.75 v21.88,23.88
N$39
  Bottom 0.25: IC3.10 12.79,5.97 X1.2 13.09,3.96 CO2.2
N$40
  Bottom 0.25: IC3.9 14.06,6.57 15.88,4.75 18.71,4.75 X1.1 19.26,4.33 CO1.2
N$41  (via drill 0.5)
  Top 0.25: CUSB.1 9.58,8.62 v7.75,8.62
  Bottom 0.25: IC3.14 7.71,8.59 v7.75,8.62
N$42
  Bottom 0.25: IC3.15 7.71,16.25 K2.D-
N$43
  Bottom 0.25: IC3.16 8.98,18.27 8.62,18.62 7.12,18.62 6.75,18.25 6.75,17.29 K2.D+
N$44  (via drill 0.5)
  Top 0.25: v21.75,10.12 21.68,10.2 RCLR.1 20.04,11.58 v20,11.62 | v3.5,2 3.44,2.06 S1.4 | v8.88,19.88 8.88,16.88 v10.38,15.38
  Bottom 0.25: v21.75,10.12 22.25,10.12 24.25,8.12 24.25,7.17 IC3.1 | v20,11.62 20,12.12 19.25,12.88 16.75,12.88 14.5,15.12 10.62,15.12 v10.38,15.38 8.88,15.38 8.12,14.62 8.12,11.38 6.5,9.75 6.5,5 v3.5,2 | K1.6 7.35,29.38 10.5,29.38 11.25,28.62 11.25,28.12 11.5,27.88 13.38,27.88 14,27.25 14,26.12 12,24.12 12,22.62 11.25,21.88 9.38,21.88 8.88,21.38 v8.88,19.88
N$45  (via drill 0.5)
  Top 0.25: v3.5,4.62 1.29,4.62 S1.3
  Bottom 0.25: v3.5,4.62 5.88,7 5.88,10 7.5,11.62 7.5,15.12 8.75,16.38 9.62,16.38 10.25,17 IC3.17 10.25,18.89 RUSR.1
N$46  (via drill 0.5)
  Top 0.25: K1.5 7.23,25.38 14.38,25.38 v14.5,25.5
  Bottom 0.25: IC3.28 24.93,17.43 28,20.5 28,25.88 27.31,26.56 25.94,26.56 25.38,27.12 20.62,27.12 19.88,27.88 17.12,27.88 16.38,27.12 16.38,26.12 15.5,25.25 14.75,25.25 v14.5,25.5
N$47
  Top 0.25: RPGM.1 25.56,15.51 JLVP.1
N$49  (via drill 0.5)
  Top 0.25: v20.62,20.12 18,20.12 17.62,20.5 17.62,23.12 16.62,24.12 11.88,24.12 11.25,24.75 5.25,24.75 4.02,25.98 K1.3
  Bottom 0.25: IC3.27 22.95,18.55 22.75,18.75 22,18.75 v20.62,20.12
N$50  (via drill 0.5)
  Top 0.25: v20.62,18.88 18.5,18.88 17,20.38 17,22.88 16.38,23.5 v10.5,23.5 | JLVP.2 v25.13,12.13 v25.12,12.12 | v11.25,26.25 8.12,26.25 7.12,27.25 5.36,27.25 K1.4
  Bottom 0.25: v20.62,18.88 21.68,17.82 IC3.26 21.62,17.38 21.88,16.88 22.75,16 23.5,16 25.12,14.38 v25.12,12.12 | v11.25,26.25 10.5,25.5 v10.5,23.5
PCLK  (via drill 0.5)
  Top 0.25: v19.5,25.25 19,25.25 18.62,24.88 18.62,21.38 19,21 21,21 21.5,20.5 21.5,17.62 20,16.12 v20,14.75
  Bottom 0.25: IC1.5 18.93,22.8 19.12,23 19.12,24.88 v19.5,25.25 | IC3.6 17.87,9.37 17.88,9.38 18.62,10.12 20.12,10.12 21.25,11.25 21.25,14 20.5,14.75 v20,14.75
QB  (via drill 0.5)
  Top 0.3: Q4.1 37.75,23.87 37.75,22 36.13,20.39 36.13,19.11 v36.5,18.75 36.13,18.39 IC2.13
  Bottom 0.3: R4.2 30.06,16.68 31.38,18 36.13,18 36.5,18.36 v36.5,18.75
QE  (via drill 0.5)
  Top 0.3: v32.25,9 32.24,10.87 IC2.1
  Bottom 0.3: Q3.2 31.5,4.45 31.5,5.88 | 31.5,5.88 31.5,8.25 v32.25,9 | Z1.A 31.25,6.12 31.5,5.88
QE2
  Top 0.3: IC2.12 37.41,20.53 39.62,22.75 Q4.2
RNG1
  Top 0.3: R7.2 42.67,8.45 41.25,9.88 41.25,10.83 IC2.8 41.25,10.9 41.25,12.12 41.64,12.51 R31.2
RNG2
  Top 0.3: R8.2 41.22,19.54 IC2.9 41.25,16.98 41.25,16 41.77,15.48 R33.2
RX
  Top 0.3: IC2.3 34.87,9.87 34.38,9.38 34.38,5.33 C4.-
SCLK  (via drill 0.5)
  Top 0.25: v22.38,20.12 22.38,16.38 v21.62,15.62
  Bottom 0.25: IC1.19 23.13,20.88 v22.38,20.12 | IC3.22 16.6,16.02 17,15.62 v21.62,15.62
SDI
  Bottom 0.25: IC1.2 18.87,20.88 19.25,20.5 19.25,19.75 18.88,19.38 16.5,19.38 15.33,18.2 IC3.21
SDO
  Bottom 0.25: 11.5,17.45 IC3.18 11.52,19.77 12.49,20.74 14.51,20.74 15,20.25 15.01,20.24 IC1.1
VBUS
  Top 0.4: K2.VBUS 5.87,11.49 7.38,13 11.82,13 D3.1
  Bottom 0.4: K1.1 0.62,25.19 0.62,16.5 5.5,11.62 5.46,11.57 K2.VBUS
VREG
  Top 0.3: C5.2 39.95,9 IC2.7
VREG2
  Top 0.3: C6.2 39.95,18.95 IC2.10

### Text on the board
tDocu: Open | USB | (C) | FXO | v0.90 | A.Varvitsiotis | 2011